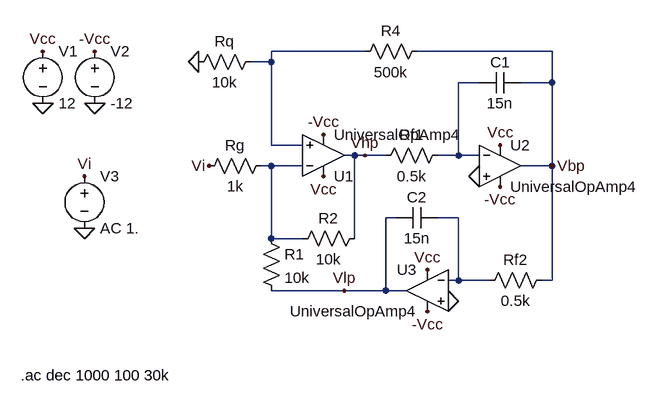
[diagram p0: schematic khn_deneme.asc]
khn_deneme.asc, the LTspice schematic file:
Version 4
SHEET 1 880 680
WIRE 112 -80 -32 -80
WIRE 400 -80 192 -80
WIRE -32 -64 -32 -80
WIRE -32 -64 -64 -64
WIRE 288 -32 256 -32
WIRE 400 -32 400 -80
WIRE 400 -32 352 -32
WIRE -32 64 -32 -64
WIRE 16 64 -32 64
WIRE 96 80 80 80
WIRE 112 80 96 80
WIRE 144 80 112 80
WIRE 256 80 256 -32
WIRE 256 80 224 80
WIRE 288 80 256 80
WIRE -32 96 -48 96
WIRE 16 96 -32 96
WIRE 400 96 400 -32
WIRE 400 96 352 96
WIRE 160 176 144 176
WIRE 256 176 224 176
WIRE -32 208 -32 96
WIRE 16 208 -32 208
WIRE 96 208 96 80
WIRE 256 272 256 176
WIRE 256 272 240 272
WIRE 304 272 256 272
WIRE 400 272 400 96
WIRE 400 272 384 272
WIRE 80 288 -32 288
WIRE 144 288 144 176
WIRE 144 288 80 288
WIRE 176 288 144 288
FLAG -144 -64 0
FLAG 288 112 0
FLAG 240 304 0
FLAG -304 0 0
FLAG -384 0 0
FLAG -384 -80 Vcc
FLAG 48 112 Vcc
FLAG 320 64 Vcc
FLAG 208 256 Vcc
FLAG -304 -80 -Vcc
FLAG 48 48 -Vcc
FLAG 320 128 -Vcc
FLAG 208 320 -Vcc
FLAG 400 96 Vbp
FLAG 80 288 Vlp
FLAG 112 80 Vhp
FLAG -320 192 0
FLAG -128 96 Vi
FLAG -320 112 Vi
SYMBOL OpAmps\\UniversalOpAmp4 48 80 M180
SYMATTR InstName U1
SYMBOL res -48 192 R0
SYMATTR InstName R1
SYMATTR Value 10k
SYMBOL res 112 192 R90
WINDOW 0 0 56 VBottom 2
WINDOW 3 32 56 VTop 2
SYMATTR InstName R2
SYMATTR Value 10k
SYMBOL res -32 80 R90
WINDOW 0 0 56 VBottom 2
WINDOW 3 32 56 VTop 2
SYMATTR InstName Rg
SYMATTR Value 1k
SYMBOL res 240 64 R90
WINDOW 0 0 56 VBottom 2
WINDOW 3 32 56 VTop 2
SYMATTR InstName Rf1
SYMATTR Value 0.5k
SYMBOL res -48 -80 R90
WINDOW 0 0 56 VBottom 2
WINDOW 3 32 56 VTop 2
SYMATTR InstName Rq
SYMATTR Value 10k
SYMBOL OpAmps\\UniversalOpAmp4 320 96 R0
SYMATTR InstName U2
SYMBOL cap 352 -48 R90
WINDOW 0 0 32 VBottom 2
WINDOW 3 32 32 VTop 2
SYMATTR InstName C1
SYMATTR Value 15n
SYMBOL res 208 -96 R90
WINDOW 0 0 56 VBottom 2
WINDOW 3 32 56 VTop 2
SYMATTR InstName R4
SYMATTR Value 500k
SYMBOL res 400 256 R90
WINDOW 0 0 56 VBottom 2
WINDOW 3 32 56 VTop 2
SYMATTR InstName Rf2
SYMATTR Value 0.5k
SYMBOL OpAmps\\UniversalOpAmp4 208 288 M0
SYMATTR InstName U3
SYMBOL cap 224 160 R90
WINDOW 0 0 32 VBottom 2
WINDOW 3 32 32 VTop 2
SYMATTR InstName C2
SYMATTR Value 15n
SYMBOL voltage -384 -96 R0
WINDOW 123 0 0 Left 0
WINDOW 39 0 0 Left 0
SYMATTR InstName V1
SYMATTR Value 12
SYMBOL voltage -304 -96 R0
WINDOW 123 0 0 Left 0
WINDOW 39 0 0 Left 0
SYMATTR InstName V2
SYMATTR Value -12
SYMBOL voltage -320 96 R0
WINDOW 123 0 0 Left 0
WINDOW 39 0 0 Left 0
SYMATTR InstName V3
SYMATTR Value AC 1.
TEXT -418 418 Left 2 !.ac dec 1000 100 30k

The netlist it stands for:
* khn_deneme.asc
* U1: UniversalOpAmp4 (symbol OpAmps\UniversalOpAmp4 not available, pins judged from their places): In+=N001 In-=N003 V+=Vcc V-=-Vcc OUT=Vhp
R1 N003 Vlp 10k
R2 Vhp N003 10k
Rg N003 Vi 1k
Rf1 N002 Vhp 0.5k
Rq N001 0 10k
* U2: UniversalOpAmp4 (symbol OpAmps\UniversalOpAmp4 not available, pins judged from their places): In+=0 In-=N002 V+=Vcc V-=-Vcc OUT=Vbp
C1 Vbp N002 15n
R4 Vbp N001 500k
Rf2 Vbp N004 0.5k
* U3: UniversalOpAmp4 (symbol OpAmps\UniversalOpAmp4 not available, pins judged from their places): In+=0 In-=N004 V+=Vcc V-=-Vcc OUT=Vlp
C2 N004 Vlp 15n
V1 Vcc 0 12
V2 -Vcc 0 -12
V3 Vi 0 AC 1.
.ac dec 1000 100 30k
.backanno
.end